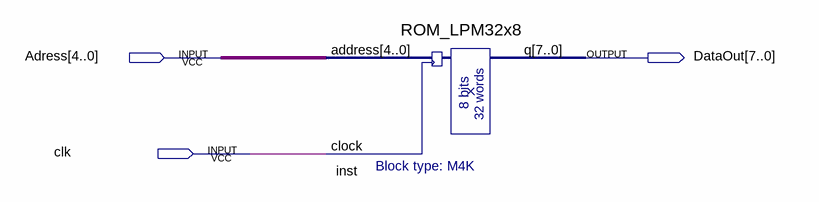
[diagram p0: schematic sheet]
// Quartus schematic part5.bdf as structural Verilog: 1 symbols, 3 pins
module part5 (
  input  [4:0] Adress,
  input  clk,
  output [7:0] DataOut
);

  ROM_LPM32x8 inst (.address(Adress), .clock(clk), .q(DataOut));
endmodule
